# Altium project STM32 demo board.PrjPcb
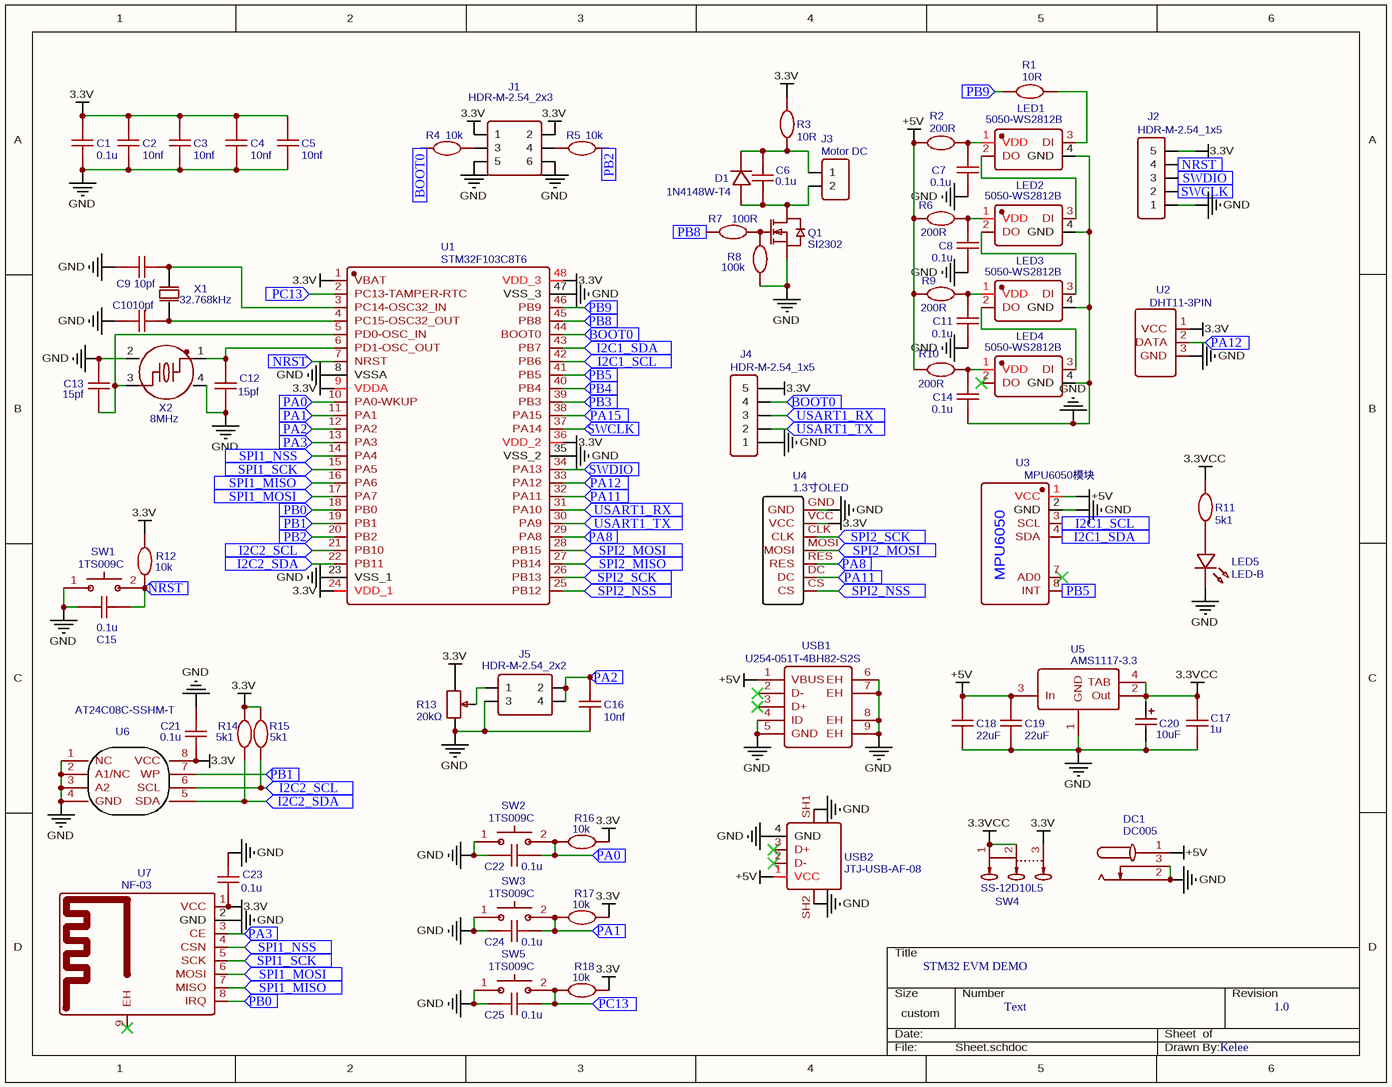
[diagram p0: Sheet.schdoc]
1 sheet, 72 parts. Net scope: flat (ports and power ports of the same name join across sheets).
Board file: PCB_stm32.pcbdoc

## Sheet Sheet.schdoc
size 260 x 202 mm

### Parts
C1  0.1u  [C0805]
C2  10nf  [C0603]
C3  10nf  [C0603]
C4  10nf  [C0603]
C5  10nf  [C0603]
C6  0.1u  [C0805]
C7  0.1u  [C0805]
C8  0.1u  [C0805]
C9  10pf  [C0603]
C10  10pf  [C0603]
C11  0.1u  [C0805]
C12  15pf  [C0603]
C13  15pf  [C0603]
C14  0.1u  [C0805]
C15  0.1u  [C0603]
C16  10nf  [C0603]
C17  1u  [C0805]
C18  22uF  [C0805]
C19  22uF  [C0805]
C20  10uF  [CAP-SMD_L3.5-W2.8]
C21  0.1u  [C0603]
C22  0.1u  [C0603]
C23  0.1u  [C0603]
C24  0.1u  [C0603]
C25  0.1u  [C0603]
D1  1N4148W-T4  [SOD-123_L2.8-W1.8-LS3.7-RD]
DC1  DC005  [DC-IN-TH_DC005]
J1  HDR-M-2.54_2x3  [HDR-M-2.54_2X3]
J2  HDR-M-2.54_1x5  [HDR-M-2.54_1X5]
J3  Motor DC  [HDR-M-2.54_1X2]
J4  HDR-M-2.54_1x5  [HDR-M-2.54_1X5]
J5  HDR-M-2.54_2x2  [HDR-M-2.54_2X2]
LED1  5050-WS2812B  [LED-SMD_4P-L5.0-W5.0-BL_XL-5050RGBC]
LED2  5050-WS2812B  [LED-SMD_4P-L5.0-W5.0-BL_XL-5050RGBC]
LED3  5050-WS2812B  [LED-SMD_4P-L5.0-W5.0-BL_XL-5050RGBC]
LED4  5050-WS2812B  [LED-SMD_4P-L5.0-W5.0-BL_XL-5050RGBC]
LED5  LED-B  [LED0603_BLUE]
Q1  SI2302  [SOT-23-3_L2.9-W1.3-P1.90-LS2.4-BR]
R1  10R  [R0603]
R2  200R  [R0805]
R3  10R  [R0805]
R4  10k  [R0603]
R5  10k  [R0603]
R6  200R  [R0805]
R7  100R  [R0603]
R8  100k  [R0603]
R9  200R  [R0805]
R10  200R  [R0805]
R11  5k1  [R0603]
R12  10k  [R0603]
R13  20kΩ  [RES-ADJ-TH_3296W-1-203]
R14  5k1  [R0603]
R15  5k1  [R0603]
R16  10k  [R0603]
R17  10k  [R0603]
R18  10k  [R0603]
SW1  1TS009C  [SW-SMD_L6.0-W6.0-P6.00-LS8.0]
SW2  1TS009C  [SW-SMD_L6.0-W6.0-P6.00-LS8.0]
SW3  1TS009C  [SW-SMD_L6.0-W6.0-P6.00-LS8.0]
SW4  SS-12D10L5  [SW-TH_SS-12D10L5]
SW5  1TS009C  [SW-SMD_L6.0-W6.0-P6.00-LS8.0]
U1  STM32F103C8T6  [LQFP-48_L7.0-W7.0-P0.50-LS9.0-BL]
U2  DHT11-3PIN  [DHT11-3PIN]
U3  MPU6050模块  [MPU6050模块]
U4  1.3寸OLED  [1.3寸OLED]
U5  AMS1117-3.3  [SOT-223_L6.5-W3.5-P2.30-LS7.0-BR]
U6  AT24C08C-SSHM-T  [SOIC-8_L5.0-W4.0-P1.27-LS6.0-BL]
U7  NF-03  [WIRELM-SMD_AI-THINKER_NF-03]
USB1  U254-051T-4BH82-S2S  [MICRO-USB-SMD_U254-051T-4BH82-S2S]
USB2  JTJ-USB-AF-08  [USB-A-TH__USB-AF-90]
X1  32.768kHz  [OSC-TH_BD3.1-P0.8-D0.3]
X2  8MHz  [CRYSTAL-SMD_4P-L3.2-W2.5-BL]

### Ports
BOOT0 (in), I2C1_SCL (in), I2C1_SDA (in), I2C2_SCL (in), I2C2_SDA (in), NRST (in), PA0 (in), PA1 (in), PA2 (in), PA3 (in), PA8 (in), PA11 (in), PA12 (in), PA15 (in), PB0 (in), PB1 (in), PB2 (in), PB3 (in), PB4 (in), PB5 (in), PB8 (in), PB9 (in), PC13 (in), SPI1_MISO (in), SPI1_MOSI (in), SPI1_NSS (in), SPI1_SCK (in), SPI2_MISO (in), SPI2_MOSI (in), SPI2_NSS (in), SPI2_SCK (in), SWCLK (in), SWDIO (in), USART1_RX (in), USART1_TX (in)

### Nets
3.3V: C1.2 C2.2 C3.2 C4.2 C5.2 C21.2 C23.2 J1.1 J1.2 J2.5 J4.5 R3.2 R12.2 R13.3 R14.2 R15.2 R16.2 R17.2 R18.2 SW4.3 U1.1(VBAT) U1.9(VDDA) U1.24(VDD_1) U1.36(VDD_2) U1.48(VDD_3) U2.1(VCC) U4.VCC U6.8(VCC) U7.1(VCC)
3.3VCC: C17.2 C20.1 R11.1 SW4.1 SW4.2 U5.2(Out) U5.4(TAB)
+5V: C18.2 C19.2 DC1.1 R2.1 R6.1 R9.1 R10.1 U3.1(VCC) U5.3(In) USB1.1(VBUS) USB2.1(VCC)
GND: C1.1 C2.1 C3.1 C4.1 C5.1 C7.2 C8.2 C9.2 C10.1 C11.2 C12.1 C13.1 C14.2 C15.2 C16.1 C17.1 C18.1 C19.1 C20.2 C21.1 C22.2 C23.1 C24.2 C25.2 DC1.2 DC1.3 J1.5 J1.6 J2.1 J4.1 J5.3 LED1.4(GND) LED2.4(GND) LED3.4(GND) LED4.4(GND) LED5.2 Q1.2(S) R8.1 R13.1 SW1.1 SW2.1 SW3.1 SW5.1 U1.8(VSSA) U1.23(VSS_1) U1.35(VSS_2) U1.47(VSS_3) U2.3(GND) U3.2(GND) U4.GND U5.1(GND) U6.1(NC) U6.2(A1/NC) U6.3(A2) U6.4(GND) U7.2(GND) USB1.4(ID) USB1.5(GND) USB1.6(EH) USB1.7(EH) USB1.8(EH) USB1.9(EH) USB2.4(GND) USB2.SH1 USB2.SH2 X2.2(GND) X2.4(GND)
NetC6_1: C6.1 D1.2(A) J3.2 Q1.3(D)
NetC6_2: C6.2 D1.1(C) J3.1 R3.1
NetC7_1: C7.1 LED1.1(VDD) R2.2
NetC8_1: C8.1 LED2.1(VDD) R6.2
NetC9_1: C9.1 U1.3(PC14-OSC32_IN) X1.1(OSC1)
NetC10_2: C10.2 U1.4(PC15-OSC32_OUT) X1.2(OSC2)
NetC11_1: C11.1 LED3.1(VDD) R9.2
NetC12_2: C12.2 U1.6(PD1-OSC_OUT) X2.1
NetC13_2: C13.2 U1.5(PD0-OSC_IN) X2.3
NetC14_1: C14.1 LED4.1(VDD) R10.2
NetC15_1: C15.1 J2.4 R12.1 SW1.2 U1.7(NRST) ; port NRST
NetC16_2: C16.2 J5.2 J5.4 U1.12(PA2) ; port PA2
NetC22_1: C22.1 R16.1 SW2.2 U1.10(PA0-WKUP) ; port PA0
NetC24_1: C24.1 R17.1 SW3.2 U1.11(PA1) ; port PA1
NetC25_1: C25.1 R18.1 SW5.2 U1.2(PC13-TAMPER-RTC) ; port PC13
NetJ1_3: J1.3 R4.1
NetJ1_4: J1.4 R5.2
NetJ2_2: J2.2 U1.37(PA14) ; port SWCLK
NetJ2_3: J2.3 U1.34(PA13) ; port SWDIO
NetJ4_2: J4.2 U1.30(PA9) ; port USART1_TX
NetJ4_3: J4.3 U1.31(PA10) ; port USART1_RX
NetJ4_4: J4.4 R4.2 U1.44(BOOT0) ; port BOOT0
NetJ5_1: J5.1 R13.2
NetLED1_2: LED1.2(DO) LED2.3(DI)
NetLED1_3: LED1.3(DI) R1.2
NetLED2_2: LED2.2(DO) LED3.3(DI)
NetLED3_2: LED3.2(DO) LED4.3(DI)
NetLED5_1: LED5.1 R11.2
NetQ1_1: Q1.1(G) R7.2 R8.2
NetR1_1: R1.1 U1.46(PB9) ; port PB9
NetR5_1: R5.1 U1.20(PB2) ; port PB2
NetR7_1: R7.1 U1.45(PB8) ; port PB8
NetR14_1: R14.1 U1.22(PB11) U6.5(SDA) ; port I2C2_SDA
NetR15_1: R15.1 U1.21(PB10) U6.6(SCL) ; port I2C2_SCL
NetU1_13: U1.13(PA3) U7.3(CE) ; port PA3
NetU1_14: U1.14(PA4) U7.4(CSN) ; port SPI1_NSS
NetU1_15: U1.15(PA5) U7.5(SCK) ; port SPI1_SCK
NetU1_16: U1.16(PA6) U7.7(MISO) ; port SPI1_MISO
NetU1_17: U1.17(PA7) U7.6(MOSI) ; port SPI1_MOSI
NetU1_18: U1.18(PB0) U7.8(IRQ) ; port PB0
NetU1_19: U1.19(PB1) U6.7(WP) ; port PB1
NetU1_25: U1.25(PB12) U4.CS ; port SPI2_NSS
NetU1_26: U1.26(PB13) U4.CLK ; port SPI2_SCK
NetU1_27: U1.27(PB14) ; port SPI2_MISO
NetU1_28: U1.28(PB15) U4.MOSI ; port SPI2_MOSI
NetU1_29: U1.29(PA8) U4.RES ; port PA8
NetU1_32: U1.32(PA11) U4.DC ; port PA11
NetU1_33: U1.33(PA12) U2.2(DATA) ; port PA12
NetU1_38: U1.38(PA15) ; port PA15
NetU1_39: U1.39(PB3) ; port PB3
NetU1_40: U1.40(PB4) ; port PB4
NetU1_41: U1.41(PB5) U3.8(INT) ; port PB5
NetU1_42: U1.42(PB6) U3.3(SCL) ; port I2C1_SCL
NetU1_43: U1.43(PB7) U3.4(SDA) ; port I2C1_SDA

Not connected (* = marked no-connect by the designer): LED4 2(DO)*; U3 7(AD0)*; U7 9(EH)*; USB1 2(D-)* 3(D+)*; USB2 2(D-)* 3(D+)*

### Notes on the sheet
- STM32 EVM DEMO
- Text
- 1.0
- Kelee
- (in symbol MPU6050模块) MPU6050

### Library data of the parts
C1 C6-C8 C11 C14 C15 C21-C25 = 0.1u: nameAlias: Value(F); Contributor: LCEDA_Lib; spicePre: C
  C1 C6-C8 C11 C14 C15 C22-C25: spiceSymbolName: C_0805_US
  C21: spiceSymbolName: C_0603_US
C2-C5 C16 = 10nf: nameAlias: Value(F); Contributor: LCEDA_Lib; spicePre: C; spiceSymbolName: C_0603_US
C9 C10 = 10pf: nameAlias: Value(F); Contributor: LCEDA_Lib; spicePre: C; spiceSymbolName: C_0603_US
C12 C13 = 15pf: nameAlias: Value(F); Contributor: LCEDA_Lib; spicePre: C; spiceSymbolName: C_0603_US
C17 = 1u: nameAlias: Value(F); Contributor: LCEDA_Lib; spicePre: C; spiceSymbolName: C_0805_US
C18 C19 = 22uF: BOM_Manufacturer: Samsung Electro-Mechanics; BOM_Manufacturer Part: CL21A226MAYNNNE; nameAlias: Capacitance; Contributor: LCSC; BOM_Supplier: LCSC; BOM_Supplier Part: C602037; BOM_JLCPCB Part Class: Extended Part; spicePre: C; spiceSymbolName: CL21A226MAYNNNE
C20 = 10uF: BOM_Manufacturer: AVX; BOM_Manufacturer Part: TAJB106M020RNJ; nameAlias: Capacitance; BOM_Supplier: LCSC; BOM_Supplier Part: C99353; BOM_JLCPCB Part Class: Extended Part; spicePre: C; spiceSymbolName: TAJB106M020RNJ
D1 = 1N4148W-T4: BOM_Manufacturer: Guangdong Hottech; Contributor: LCSC; BOM_Supplier: LCSC; BOM_Supplier Part: C181134; BOM_Manufacturer Part: 1N4148W-T4; BOM_JLCPCB Part Class: Extended Part; spicePre: D; spiceSymbolName: 1N4148W-T4
DC1 = DC005: BOM_Manufacturer: SHOU HAN; Contributor: LCSC; BOM_Supplier: LCSC; BOM_Supplier Part: C431533; BOM_Manufacturer Part: DC005; BOM_JLCPCB Part Class: Extended Part; spicePre: D; spiceSymbolName: DC005_C431533
J1 = HDR-M-2.54_2x3: Contributor: LCEDA_Lib; BOM_Supplier Part: C65114; BOM_Supplier: LCSC; spicePre: J; spiceSymbolName: HDR-M-2.54_2x3
J2 J4 = HDR-M-2.54_1x5: Contributor: LCEDA_Lib; BOM_Supplier Part: C358687; BOM_Supplier: LCSC; spicePre: J; spiceSymbolName: HDR-M-2.54_1x5
J3 = Motor DC: Contributor: LCEDA_Lib; BOM_Supplier Part: C124375; BOM_Supplier: LCSC; spicePre: J; spiceSymbolName: HDR-M-2.54_1x2
J5 = HDR-M-2.54_2x2: Contributor: LCEDA_Lib; BOM_Supplier Part: C66690; BOM_Supplier: LCSC; spicePre: J; spiceSymbolName: HDR-M-2.54_2x2
LED1-LED4 = 5050-WS2812B: BOM_Manufacturer: XINGLIGHT(成兴光); BOM_Manufacturer Part: XL-5050RGBC-WS2812B; Contributor: LCSC; BOM_Supplier: LCSC; BOM_Supplier Part: C2843785; BOM_JLCPCB Part Class: Extended Part; spicePre: L; spiceSymbolName: XL-5050RGBC-WS2812B
LED5 = LED-B: BOM_Manufacturer: EVERLIGHT(台湾亿光); BOM_Manufacturer Part: 19-217/BHC-ZL1M2RY/3T; Contributor: LCEDA_01; BOM_Supplier Part: C72041; BOM_Supplier: LCSC; spicePre: L; spiceSymbolName: LED-0603_B
Q1 = SI2302: BOM_Manufacturer: TECH PUBLIC(台舟); Contributor: LCSC; BOM_Supplier: LCSC; BOM_Supplier Part: C2841377; BOM_Manufacturer Part: SI2302; BOM_JLCPCB Part Class: Extended Part; spicePre: Q; spiceSymbolName: SI2302_C2841377
R1 R3 = 10R: nameAlias: Value(Ω); Contributor: LCEDA_Lib; spicePre: R
  R1: spiceSymbolName: R_0603_EU
  R3: spiceSymbolName: R_0805_EU
R2 R6 R9 R10 = 200R: nameAlias: Value(Ω); Contributor: LCEDA_Lib; spicePre: R; spiceSymbolName: R_0805_EU
R4 R5 R12 R16-R18 = 10k: nameAlias: Value(Ω); Contributor: LCEDA_Lib; spicePre: R; spiceSymbolName: R_0805_EU
R7 = 100R: nameAlias: Value(Ω); Contributor: LCEDA_Lib; spicePre: R; spiceSymbolName: R_0603_EU
R8 = 100k: nameAlias: Value(Ω); Contributor: LCEDA_Lib; spicePre: R; spiceSymbolName: R_0603_EU
R11 R14 R15 = 5k1: nameAlias: Value(Ω); Contributor: LCEDA_Lib; spicePre: R; spiceSymbolName: R_0805_EU
R13 = 20kΩ: BOM_Manufacturer: Chengdu Guosheng Tech; BOM_Manufacturer Part: 3296W-1-203; Resistance(Ohms): 20K; nameAlias: Resistance; Contributor: LCSC; BOM_Supplier: LCSC; BOM_Supplier Part: C330433; Resistance (Ohms): 20K; BOM_JLCPCB Part Class: Extended Part; spicePre: R; spiceSymbolName: 3296W-1-203_C330433
SW1-SW3 SW5 = 1TS009C: BOM_Manufacturer: HYP; BOM_Manufacturer Part: 1TS009C-2500-5000; Contributor: LCSC; BOM_Supplier: LCSC; BOM_Supplier Part: C256102; BOM_JLCPCB Part Class: Extended Part; spicePre: S; spiceSymbolName: 1TS009C-2500-5000
SW4 = SS-12D10L5: BOM_Manufacturer: XKB Enterprise; Contributor: LCSC; BOM_Supplier: LCSC; BOM_Supplier Part: C319012; BOM_Manufacturer Part: SS-12D10L5; BOM_JLCPCB Part Class: Extended Part; spicePre: S; spiceSymbolName: SS-12D10L5
U1 = STM32F103C8T6: BOM_Manufacturer: STMicroelectronics; timeStamp: 1455028086; BOM_Supplier: LCSC; BOM_Manufacturer Part: STM32F103C8T6; BOM_Supplier Part: C8734; BOM_JLCPCB Part Class: Basic Part; spicePre: U; spiceSymbolName: STM32F103C8T6
U2 = DHT11-3PIN: Contributor: Congs.Chen; spicePre: U; spiceSymbolName: DHT11-3PIN
U3 = MPU6050模块: Contributor: aoji.zhu; spicePre: U; spiceSymbolName: MPU6050模块 COPY
U4 = 1.3寸OLED: Contributor: Biu_rao; spicePre: U; spiceSymbolName: 1.3寸OLED COPY
U5 = AMS1117-3.3: BOM_Manufacturer: SK; Contributor: LCSC; BOM_Supplier: LCSC; BOM_Supplier Part: C165482; BOM_Manufacturer Part: AMS1117-3.3; BOM_JLCPCB Part Class: Extended Part; spicePre: U; spiceSymbolName: AMS1117-3.3_C165482
U6 = AT24C08C-SSHM-T: BOM_Manufacturer: MICROCHIP; BOM_Supplier: LCSC; BOM_Manufacturer Part: AT24C08C-SSHM-T; BOM_Supplier Part: C31422; BOM_JLCPCB Part Class: Extended Part; spicePre: U; spiceSymbolName: AT24C08C-SSHM-T
U7 = NF-03: BOM_Manufacturer: Ai-Thinker(安信可); Contributor: lcsc; BOM_Supplier: LCSC; BOM_Supplier Part: C115101; BOM_Manufacturer Part: NF-03; link: https://atta.szlcsc.com/upload/public/pdf/source/20180412/C115101_9BA24B501AB1D00CD0E5D6E44E81803D.pdf; BOM_JLCPCB Part Class: Extended Part; spicePre: U; spiceSymbolName: NF-03
USB1 = U254-051T-4BH82-S2S: BOM_Manufacturer: XKB Connectivity(中国星坤); Contributor: LCSC; BOM_Supplier: LCSC; BOM_Supplier Part: C908456; BOM_Manufacturer Part: U254-051T-4BH82-S2S; BOM_JLCPCB Part Class: Extended Part; spicePre: U; spiceSymbolName: U254-051T-4BH82-S2S
USB2 = JTJ-USB-AF-08: Contributor: LCSC; BOM_Supplier: LCSC; BOM_Manufacturer Part: JTJ-USB-AF-08; BOM_Supplier Part: C2345; BOM_JLCPCB Part Class: Extended Part; spicePre: U; spiceSymbolName: JTJ-USB-AF-08
X1 = 32.768kHz: BOM_Manufacturer: HCI(杭晶); BOM_Manufacturer Part: FL38T2-32.768-NTLLLDT; nameAlias: Frequency; Contributor: LCSC; BOM_Supplier: LCSC; BOM_Supplier Part: C2848215; spicePre: X; spiceSymbolName: FL38T2-32.768-NTLLLDT
X2 = 8MHz: BOM_Manufacturer: Suzhou Liming Elec; BOM_Manufacturer Part: 3225-8.00-8-10-10/A; nameAlias: Frequency; Contributor: LCSC; BOM_Supplier: LCSC; BOM_Supplier Part: C518135; BOM_JLCPCB Part Class: Extended Part; spicePre: X; spiceSymbolName: 3225-8.00-8-10-10/A